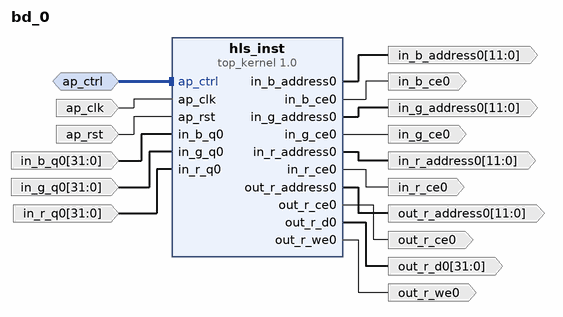
[diagram p0: block diagram of the top level]
# Vivado block design bd_0, xczu3eg-sbva484-1-e, Vivado 2025.1.1
create_bd_design bd_0

create_bd_intf_port -mode Slave -vlnv xilinx.com:interface:acc_handshake_rtl:1.0 ap_ctrl
create_bd_port -dir I -type clk ap_clk
set_property -dict {CONFIG.FREQ_HZ 100000000.0} [get_bd_ports ap_clk]
create_bd_port -dir I -type rst ap_rst
set_property -dict {CONFIG.POLARITY ACTIVE_HIGH} [get_bd_ports ap_rst]
create_bd_port -dir O -from 11 -to 0 -type data in_b_address0
create_bd_port -dir O in_b_ce0
create_bd_port -dir I -from 31 -to 0 -type data in_b_q0
create_bd_port -dir O -from 11 -to 0 -type data in_g_address0
create_bd_port -dir O in_g_ce0
create_bd_port -dir I -from 31 -to 0 -type data in_g_q0
create_bd_port -dir O -from 11 -to 0 -type data in_r_address0
create_bd_port -dir O in_r_ce0
create_bd_port -dir I -from 31 -to 0 -type data in_r_q0
create_bd_port -dir O -from 11 -to 0 -type data out_r_address0
create_bd_port -dir O out_r_ce0
create_bd_port -dir O -from 31 -to 0 -type data out_r_d0
create_bd_port -dir O out_r_we0

create_bd_cell -type ip -vlnv xilinx.com:hls:top_kernel:1.0 hls_inst

# ---- connections ----

connect_bd_intf_net -intf_net ap_ctrl_0_1 [get_bd_intf_ports ap_ctrl] [get_bd_intf_pins hls_inst/ap_ctrl]
connect_bd_net -net ap_clk_0_1 [get_bd_ports ap_clk] [get_bd_pins hls_inst/ap_clk]
connect_bd_net -net ap_rst_0_1 [get_bd_ports ap_rst] [get_bd_pins hls_inst/ap_rst]
connect_bd_net [get_bd_pins hls_inst/in_b_address0] [get_bd_ports in_b_address0]
connect_bd_net [get_bd_pins hls_inst/in_b_ce0] [get_bd_ports in_b_ce0]
connect_bd_net [get_bd_pins hls_inst/in_g_address0] [get_bd_ports in_g_address0]
connect_bd_net [get_bd_pins hls_inst/in_g_ce0] [get_bd_ports in_g_ce0]
connect_bd_net [get_bd_pins hls_inst/in_r_address0] [get_bd_ports in_r_address0]
connect_bd_net [get_bd_pins hls_inst/in_r_ce0] [get_bd_ports in_r_ce0]
connect_bd_net [get_bd_pins hls_inst/out_r_address0] [get_bd_ports out_r_address0]
connect_bd_net [get_bd_pins hls_inst/out_r_ce0] [get_bd_ports out_r_ce0]
connect_bd_net [get_bd_pins hls_inst/out_r_d0] [get_bd_ports out_r_d0]
connect_bd_net [get_bd_pins hls_inst/out_r_we0] [get_bd_ports out_r_we0]
connect_bd_net -net in_b_q0_0_1 [get_bd_ports in_b_q0] [get_bd_pins hls_inst/in_b_q0]
connect_bd_net -net in_g_q0_0_1 [get_bd_ports in_g_q0] [get_bd_pins hls_inst/in_g_q0]
connect_bd_net -net in_r_q0_0_1 [get_bd_ports in_r_q0] [get_bd_pins hls_inst/in_r_q0]

validate_bd_design
save_bd_design
